# Altium schematic sheet [4] SCS and Implausabilities.SchDoc
size A4; DocumentNumber: 5; SheetNumber: 5; SheetTotal: 11
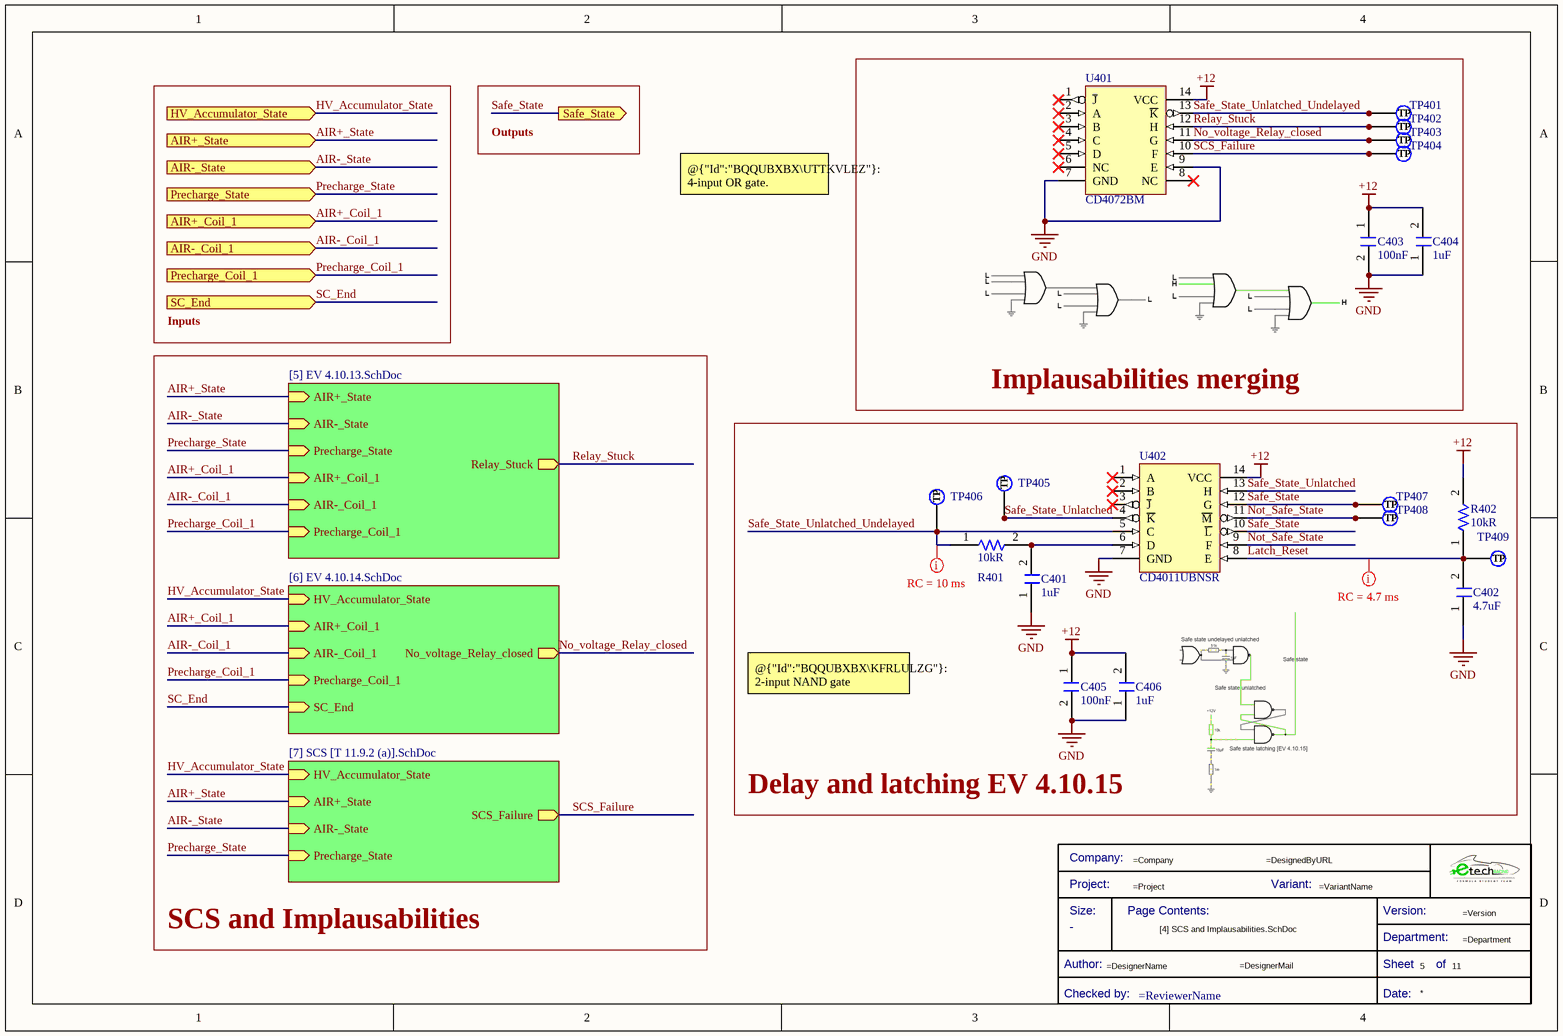
[diagram p0: [4] SCS and Implausabilities.SchDoc]

## Parts
*?  Title Block_template  (value not drawn)  (graphical)
C401  Capacitance: 1uF  [C0805FNPC-R]  (hidden comment: 885012207103)
C402  Capacitance: 4.7uF  [C0805FNPC-W]  (hidden comment: GRM219R61A475KE34D)
C403  Capacitance: 100nF  [C0805FNPC-R]  (hidden comment: 885012207098)
C404  Capacitance: 1uF  [C0805FNPC-R]  (hidden comment: 885012207103)
C405  Capacitance: 100nF  [C0805FNPC-R]  (hidden comment: 885012207098)
C406  Capacitance: 1uF  [C0805FNPC-R]  (hidden comment: 885012207103)
R401  Resistance: 10kR  [R0805FTK]  (hidden comment: CR0805-JW-103ELF)
R402  Resistance: 10kR  [R0805FTK]  (hidden comment: CR0805-JW-103ELF)
TP401  TestPoint  [TestPoint]  (value not drawn)  (no BOM)
TP402  TestPoint  [TestPoint]  (value not drawn)  (no BOM)
TP403  TestPoint  [TestPoint]  (value not drawn)  (no BOM)
TP404  TestPoint  [TestPoint]  (value not drawn)  (no BOM)
TP405  TestPoint  [TestPoint]  (value not drawn)  (no BOM)
TP406  TestPoint  [TestPoint]  (value not drawn)  (no BOM)
TP407  TestPoint  [TestPoint]  (value not drawn)  (no BOM)
TP408  TestPoint  [TestPoint]  (value not drawn)  (no BOM)
TP409  TestPoint  [TestPoint]  (value not drawn)  (no BOM)
U401  CD4072BM  [ARRAY_4_OR]
U402  Manufacturer Part Number: CD4011UBNSR  [ARRAY_4_NAND]  (hidden comment: CD4011UBSNR)

## Blocks framed on the sheet
Implausabilities merging: C403 C404 TP401-TP404 U401
Delay and latching EV 4.10.15: C401 C402 C405 C406 R401 R402 TP405-TP409 U402

## Sub-sheets
EV 4.10.13 = [5] EV 4.10.13.SchDoc: AIR+_Coil_1 (in), AIR-_Coil_1 (in), Precharge_Coil_1 (in), AIR+_State (in), AIR-_State (in), Precharge_State (in), Relay_Stuck (out)
EV 4.10.14 = [6] EV 4.10.14.SchDoc: AIR+_Coil_1 (in), AIR-_Coil_1 (in), HV_Accumulator_State (in), No_voltage_Relay_closed (out), Precharge_Coil_1 (in), SC_End (in)
SCS [T 11.9.2 (a)] = [7] SCS [T 11.9.2 (a)].SchDoc: HV_Accumulator_State (in), AIR+_State (in), AIR-_State (in), Precharge_State (in), SCS_Failure (out)

## Ports
AIR+_Coil_1 (in), AIR+_State (in), AIR-_Coil_1 (in), AIR-_State (in), HV_Accumulator_State (in), Precharge_Coil_1 (in), Precharge_State (in), Safe_State (out), SC_End (in)

## Nets
+12: C403.1 C404.2 C405.1 C406.2 R402.2 U401.14(VCC) U402.14(VCC)
GND: C401.1 C402.1 C403.2 C404.1 C405.2 C406.1 U401.7(GND) U401.9(E) U402.7(GND)
AIR+_Coil_1: port AIR+_Coil_1, sheet EV 4.10.13/AIR+_Coil_1, sheet EV 4.10.14/AIR+_Coil_1
AIR+_State: port AIR+_State, sheet EV 4.10.13/AIR+_State, sheet SCS [T 11.9.2 (a)]/AIR+_State
AIR-_Coil_1: port AIR-_Coil_1, sheet EV 4.10.13/AIR-_Coil_1, sheet EV 4.10.14/AIR-_Coil_1
AIR-_State: port AIR-_State, sheet EV 4.10.13/AIR-_State, sheet SCS [T 11.9.2 (a)]/AIR-_State
HV_Accumulator_State: port HV_Accumulator_State, sheet EV 4.10.14/HV_Accumulator_State, sheet SCS [T 11.9.2 (a)]/HV_Accumulator_State
Latch_Reset: C402.2 R402.1 TP409.1(TP) U402.8(E)
No_voltage_Relay_closed: TP403.1(TP) U401.11(G) ; sheet EV 4.10.14/No_voltage_Relay_closed
Not_Safe_State: TP408.1(TP) U402.9(F) U402.11(~{M})
Precharge_Coil_1: port Precharge_Coil_1, sheet EV 4.10.13/Precharge_Coil_1, sheet EV 4.10.14/Precharge_Coil_1
Precharge_State: port Precharge_State, sheet EV 4.10.13/Precharge_State, sheet SCS [T 11.9.2 (a)]/Precharge_State
Relay_Stuck: TP402.1(TP) U401.12(H) ; sheet EV 4.10.13/Relay_Stuck
Safe_State: TP407.1(TP) U402.10(~{L}) U402.12(G) ; port Safe_State
Safe_State_Unlatched: TP405.1(TP) U402.4(~{K}) U402.13(H)
Safe_State_Unlatched_Undelayed: R401.1 TP401.1(TP) TP406.1(TP) U401.13(~{K}) U402.5(C)
SC_End: port SC_End, sheet EV 4.10.14/SC_End
SCS_Failure: TP404.1(TP) U401.10(F) ; sheet SCS [T 11.9.2 (a)]/SCS_Failure
NetC401_2: C401.2 R401.2 U402.6(D)

Not connected (* = marked no-connect by the designer): U401 1(~{J})* 2(A)* 3(B)* 4(C)* 5(D)* 6(NC)* 8(NC)*; U402 1(A)* 2(B)* 3(~{J})*

## Layout directives
mark named RC = 10 ms: Safe_State_Unlatched_Undelayed
mark named RC = 4.7 ms: Latch_Reset

## Notes on the sheet
- Outputs
- @{"Id":"BQQUBXBX\UTTKVLEZ"}: 4-input OR gate.
- Inputs
- @{"Id":"BQQUBXBX\KFRLULZG"}: 2-input NAND gate
- SCS and Implausabilities
- (in symbol Title Block_template) Company:; Project:; Variant:; Size:; Page Contents:; Version:; Department:; Author:; Sheet; of; Checked by:; Date:

## Library data of the parts
*? = Title Block_template: Standard Title Block; .Creator: GP; Category: Title Block; .PCBcheck: GP; .SCHcheck: GP; Checked by:: =ReviewerName; Size: -
C401 C404 C406 = C1u-50V-0805FNPC-X7R: Multilayer Ceramic Capacitor, Wcap-Csgp Series, 1 F, 10%, X7R, 50 V, 0805 [2012 Metric] Rohs Compliant: Yes; Manufacturer 1: Wurth Electronics; Voltage Rating: 50V; .Creator: GP; Supplier 1: RSComponents; Manufacturer Part Number 1: 885012207103; RoHS: Yes; Category: Ceramic Capacitors; Stock 1: 5100; Pricing 1: 50=0,27200, 250=0,25300, 500=0,22800, 1250=0,20100, 2500=0,17100 (GBP); Mount: Surface Mount; Case/Package: 0805; Case Code (Metric): 2012; Case Code (Imperial): 0805; Min Operating Temperature: -55°C; Max Operating Temperature: 85°C; Packaging: Cut Tape; Dielectric: X7R; Tolerance: 10%; Voltage Rating (DC): 50V; Length: 0.079inch; Width: 0.049inch; Thickness: 0.053inch; REACH SVHC: Unknown; RoHS Compliant: Yes; ComponentLink1URL: http://www.farnell.com/datasheets/1958501.pdf?src-supplier=Farnell; ComponentLink1Description: http://www.farnell.com/datasheets/1958501.pdf?src-supplier=Farnell; ComponentLink2URL: http://www.farnell.com/datasheets/1958501.pdf?src-supplier=Element14; ComponentLink2Description: http://www.farnell.com/datasheets/1958501.pdf?src-supplier=Element14; ComponentLink3URL: https://katalog.we-online.de/pbs/datasheet/885012107003.pdf?src-supplier=Digi-Key; ComponentLink3Description: https://katalog.we-online.de/pbs/datasheet/885012107003.pdf?src-supplier=Digi-Key; ComponentLink4URL: http://www.farnell.com/datasheets/1958501.pdf?src-supplier=Newark; ComponentLink4Description: http://www.farnell.com/datasheets/1958501.pdf?src-supplier=Newark; Supplier Part Number 1: 1813523
C402 = C4.7u-0805FNPC-X5R: 0805 4.7 uF 10 V ±10% Tolerance X5R Surface Mount Multilayer Ceramic Capacitor; Manufacturer: Murata; Voltage Rating: 10V; .Creator: GP; Category: Capacitor; ComponentLink1Description: Datasheet; ComponentLink1URL: https://eu.mouser.com/datasheet/2/396/taiyo_yuden_12132018_mlcc11_hq_e-1510082.pdf; ComponentLink2Description: Where buy it; ComponentLink2URL: https://eu.mouser.com/ProductDetail/Taiyo-Yuden/UMK212BJ224KGHT?qs=CNQs48zzdnpf%2FbZJTfp33Q%3D%3D; ComponentLink3URL: https://datasheet.ciiva.com/169/product-169527.pdf?src-supplier=Digi-Key; ComponentLink3Description: https://datasheet.ciiva.com/169/product-169527.pdf?src-supplier=Digi-Key; ComponentLink4URL: https://datasheet.ciiva.com/5414/product-5414984.pdf?src-supplier=Mouser; ComponentLink4Description: https://datasheet.ciiva.com/5414/product-5414984.pdf?src-supplier=Mouser; ComponentLink5URL: https://datasheet.ciiva.com/16467/product-16467258.pdf?src-supplier=Future+Electronics; ComponentLink5Description: https://datasheet.ciiva.com/16467/product-16467258.pdf?src-supplier=Future+Electronics; ComponentLink6URL: https://datasheet.ciiva.com/29542/product-29542667.pdf?src-supplier=Digi-Key; ComponentLink6Description: https://datasheet.ciiva.com/29542/product-29542667.pdf?src-supplier=Digi-Key; ComponentLink7URL: https://datasheet.ciiva.com/29542/product-29542668.pdf?src-supplier=Digi-Key; ComponentLink7Description: https://datasheet.ciiva.com/29542/product-29542668.pdf?src-supplier=Digi-Key; Supplier 1: Digi-Key; Manufacturer Part Number: GRM219R61A475KE34D; RoHS: Yes; Stock 1: 626992; Pricing 1: 1=0,28000, 10=0,19500, 50=0,13020, 100=0,11070, 500=0,07814, 1000=0,06838 (USD); Mount: Surface Mount; Case/Package: 0805; Case Code (Metric): 2012; Case Code (Imperial): 0805; Min Operating Temperature: -55°C; Max Operating Temperature: 85°C; Tolerance: 10%; Dielectric: X5R; Packaging: Tape and Reel; Package Quantity: 4000; Voltage Rating (DC): 10V; Termination: SMD/SMT; Voltage: 10V; Series: GRM; Construction: Flat; Length: 2mm; Width: 0.049inch; Height: 0.85mm; Depth: 1.25mm; Thickness: 0.037inch; Lead Free: Lead Free; RoHS Compliant: Yes; Supplier Part Number 1: 490-3339-1-ND
C403 C405 = C100n-50V-0805FNPC-X7R: Cap, 0.1ΜF, 50V, 10%, X7R, 0805; Manufacturer 1: Wurth Electronics; .Creator: DR; Supplier 1: RSComponents; Manufacturer Part Number 1: 885012207098; RoHS: Yes; Category: Ceramic Capacitors; Stock 1: 8000; Pricing 1: 100=0,10200, 500=0,07100, 2000=0,06100 (GBP); Mount: Surface Mount; Case/Package: 0805; Case Code (Metric): 2012; Case Code (Imperial): 0805; Min Operating Temperature: -55°C; Max Operating Temperature: 125°C; Packaging: Cut Tape; Voltage Rating: 50V; Dielectric: X7R; Tolerance: 10%; Voltage Rating (DC): 50V; Length: 0.079inch; Width: 0.049inch; Thickness: 0.035inch; REACH SVHC: Unknown; RoHS Compliant: Yes; ComponentLink1URL: http://www.farnell.com/datasheets/1958498.pdf?src-supplier=Farnell; ComponentLink1Description: http://www.farnell.com/datasheets/1958498.pdf?src-supplier=Farnell; ComponentLink2URL: http://www.farnell.com/datasheets/1958498.pdf?src-supplier=Element14; ComponentLink2Description: http://www.farnell.com/datasheets/1958498.pdf?src-supplier=Element14; ComponentLink3URL: https://katalog.we-online.de/pbs/datasheet/885012207098.pdf?src-supplier=Digi-Key; ComponentLink3Description: https://katalog.we-online.de/pbs/datasheet/885012207098.pdf?src-supplier=Digi-Key; ComponentLink4URL: http://www.farnell.com/datasheets/1958498.pdf?src-supplier=Newark; ComponentLink4Description: http://www.farnell.com/datasheets/1958498.pdf?src-supplier=Newark; Supplier Part Number 1: 1813493
R401 R402 = R10k-0805FTK: BOURNS         CR0805-JW-103ELF            Surface Mount Chip Resistor, Thick Film, CR Series, 10 kohm, 125 mW,  5%, 150 V; Temperature Coefficient: 200ppm/°C; Power Rating: 125mW; Voltage Rating: 150V; Voltage Rating (DC): 100V; .Creator: DR; Supplier 1: Arrow Electronics; Manufacturer 1: Bourns; Manufacturer Part Number 1: CR0805-JW-103ELF; RoHS: Yes; Category: Chip SMD Resistors; Stock 1: 57566; Pricing 1: 1=0,05790, 10=0,01540, 25=0,01340, 100=0,00340 (USD); Mount: Surface Mount; Case/Package: 0805; Number of Pins: 2; Contact Plating: Tin; Case Code (Metric): 2012; Case Code (Imperial): 0805; Min Operating Temperature: -55°C; Max Operating Temperature: 155°C; Tolerance: 5%; Resistor Type: Thick Film; Package Quantity: 1; Packaging: Tape and Reel; Number of Terminations: 2; Termination: SMD/SMT; Max Power Dissipation: 125mW; Features: Moisture Resistant; Series: CR0805; Construction: Rectangular; Resistance Tolerance: 5%; Technology: THICK FILM; Length: 2mm; Width: 1.25mm; Height: 0.5mm; Depth: 1.25mm; Thickness: 508um; Radiation Hardening: No; REACH SVHC: No SVHC; Military Standard: Not; RoHS Compliant: Yes; ComponentLink1URL: https://datasheet.ciiva.com/11821/0900766b80fcdb72-11821135.pdf?src-supplier=RSComponents; ComponentLink1Description: https://datasheet.ciiva.com/11821/0900766b80fcdb72-11821135.pdf?src-supplier=RSComponents; ComponentLink2URL: https://datasheet.ciiva.com/9122/chpreztr-9122374.pdf?src-supplier=Avnet; ComponentLink2Description: https://datasheet.ciiva.com/9122/chpreztr-9122374.pdf?src-supplier=Avnet; ComponentLink3URL: https://datasheet.ciiva.com/22693/1902866-22693254.pdf?src-supplier=Element14; ComponentLink3Description: https://datasheet.ciiva.com/22693/1902866-22693254.pdf?src-supplier=Element14; ComponentLink4URL: https://datasheet.ciiva.com/7986/691949-7986187.pdf?src-supplier=Element14; ComponentLink4Description: https://datasheet.ciiva.com/7986/691949-7986187.pdf?src-supplier=Element14; ComponentLink5URL: https://datasheet.ciiva.com/30065/159chpreztr-30065976.pdf?src-supplier=Onlinecomponents.com; ComponentLink5Description: https://datasheet.ciiva.com/30065/159chpreztr-30065976.pdf?src-supplier=Onlinecomponents.com; ComponentLink6URL: https://datasheet.ciiva.com/16783/70154685-16783482.pdf?src-supplier=Allied+Electronics; ComponentLink6Description: https://datasheet.ciiva.com/16783/70154685-16783482.pdf?src-supplier=Allied+Electronics; ComponentLink7URL: https://datasheet.ciiva.com/5548/chpreztr-5548491.pdf?src-supplier=Mouser; ComponentLink7Description: https://datasheet.ciiva.com/5548/chpreztr-5548491.pdf?src-supplier=Mouser; ComponentLink8URL: https://datasheet.ciiva.com/6559/chpreztr-6559900.pdf?src-supplier=Digi-Key; ComponentLink8Description: https://datasheet.ciiva.com/6559/chpreztr-6559900.pdf?src-supplier=Digi-Key; ComponentLink9URL: https://datasheet.ciiva.com/6559/chpreztr-6559901.pdf?src-supplier=Digi-Key; ComponentLink9Description: https://datasheet.ciiva.com/6559/chpreztr-6559901.pdf?src-supplier=Digi-Key; ComponentLink10URL: https://datasheet.ciiva.com/7985/1856384-7985869.pdf?src-supplier=Element14; ComponentLink10Description: https://datasheet.ciiva.com/7985/1856384-7985869.pdf?src-supplier=Element14; ComponentLink11URL: https://datasheet.ciiva.com/48692/001055517-da-01-en-smd-wid-cr0805-jw-103elf-10k-ohm-1-8w-48692118.pdf?src-supplier=Conrad; ComponentLink11Description: https://datasheet.ciiva.com/48692/001055517-da-01-en-smd-wid-cr0805-jw-103elf-10k-ohm-1-8w-48692118.pdf?src-supplier=Conrad; Supplier Part Number 1: CR0805-JW-103ELF
TP401-TP409 = TestPoint: Test Point 1x1 mm; .Creator: GP; Category: TestPoint; .PCBcheck: GP; .SCHcheck: GP
U401 = Array_2x4_OR: 2-ch, 4-input, 3-V to 18-V OR gates 14-SOIC -55 to 125; Manufacturer 1: Texas Instruments; Number of Outputs: 1; Max Supply Voltage: 18V; Min Supply Voltage: 3V; Logic Function: OR GATE; Output Current: 6.8mA; Number of Inputs: 4; Propagation Delay: 90ns; Number of Circuits: 2; Quiescent Current: 5uA; High Level Output Current: -4.2mA; Low Level Output Current: 4.2mA; Turn-On Delay Time: 120ns; Schmitt Trigger Input: No; Max Power Dissipation: 500mW; Supplier 1: Digi-Key; Manufacturer Part Number 1: CD4072BM; RoHS: Yes; Category: Logic Gates; Stock 1: 3590; Pricing 1: 1=1,37000, 10=1,22900, 25=1,16640, 100=0,95810, 250=0,89564, 500=0,79150, 1000=0,62487, 2500=0,58950 (USD); Mount: Surface Mount; Case/Package: SOIC; Number of Pins: 14; Weight: 0.004564oz; Contact Plating: Gold; Min Operating Temperature: -55°C; Max Operating Temperature: 125°C; Packaging: Rail/Tube; Package Quantity: 50; Number of Gates: 2; Number of Input Lines: 4; Number of Output Lines: 1; Number of Elements: 2; Series: 4000B; Technology: CMOS; Number of Bits: 2; Power Dissipation: 500mW; Length: 8.75mm; Width: 4mm; Height: 1.5mm; Radiation Hardening: No; Lead Free: Lead Free; RoHS Compliant: Yes; Reach SVHC Compliant: Yes; ComponentLink1URL: https://datasheet.ciiva.com/1866/cd4071b-1866640.pdf?src-supplier=Digi-Key; ComponentLink1Description: https://datasheet.ciiva.com/1866/cd4071b-1866640.pdf?src-supplier=Digi-Key; ComponentLink2URL: https://datasheet.ciiva.com/15090/getdatasheetpartid-50223-15090322.pdf?src-supplier=Verical; ComponentLink2Description: https://datasheet.ciiva.com/15090/getdatasheetpartid-50223-15090322.pdf?src-supplier=Verical; ComponentLink3URL: https://datasheet.ciiva.com/1508/1847354-1508182.pdf?src-supplier=Element14; ComponentLink3Description: https://datasheet.ciiva.com/1508/1847354-1508182.pdf?src-supplier=Element14; Supplier Part Number 1: 296-25954-5-ND
U402 = Array_4_NAND: CD4011UB Cmos Quad 2-INPUT Nand; Manufacturer: Texas Instruments; Logic Function: NAND GATE; Min Supply Voltage: 3V; Max Supply Voltage: 18V; Number of Inputs: 2; Propagation Delay: 50ns; Number of Outputs: 1; Number of Circuits: 4; Quiescent Current: 5uA; High Level Output Current: 3.4mA; Output Current: 6.8mA; Turn-On Delay Time: 120ns; .Creator: DO; Supplier 1: Digi-Key; RoHS: Yes; Category: Logic Gates; Stock 1: 964; Pricing 1: 1=0,67000, 10=0,59100, 25=0,55520, 100=0,45320, 250=0,42096, 500=0,35828, 1000=0,29575 (USD); Mount: Surface Mount; Case/Package: SOP; Number of Pins: 14; Weight: 0.007348oz; Contact Plating: Gold; Min Operating Temperature: -55°C; Max Operating Temperature: 125°C; Package Quantity: 1; Packaging: Tape and Reel; Low Level Output Current: 3.4mA; Number of Gates: 4; Number of Input Lines: 2; Number of Output Lines: 1; Number of Elements: 4; Series: 4000B; Technology: CMOS; Number of Bits: 4; Lead Free: Lead Free; RoHS Compliant: Yes; ComponentLink1URL: https://datasheet.ciiva.com/6621/cd4011ub-6621174.pdf?src-supplier=Digi-Key; ComponentLink1Description: https://datasheet.ciiva.com/6621/cd4011ub-6621174.pdf?src-supplier=Digi-Key; ComponentLink2URL: https://datasheet.ciiva.com/6621/cd4011ub-6621175.pdf?src-supplier=Digi-Key; ComponentLink2Description: https://datasheet.ciiva.com/6621/cd4011ub-6621175.pdf?src-supplier=Digi-Key; ComponentLink3URL: https://datasheet.ciiva.com/14307/cd4011ub-mil-14307943.pdf?src-supplier=Avnet; ComponentLink3Description: https://datasheet.ciiva.com/14307/cd4011ub-mil-14307943.pdf?src-supplier=Avnet; ComponentLink4URL: https://datasheet.ciiva.com/6621/cd4011ub-6621176.pdf?src-supplier=Digi-Key; ComponentLink4Description: https://datasheet.ciiva.com/6621/cd4011ub-6621176.pdf?src-supplier=Digi-Key; Supplier Part Number 1: 296-31485-1-ND; ComponentLink5Description: Where buy it; ComponentLink5URL: https://www.digikey.es/es/products/detail/texas-instruments/CD4011UBNSR/1690702?s=N4IgTCBcDaIMIBEAsAGAjGgqgIQHIGUAlAAhAF0BfIA